# EAGLE design isa_cvx (EAGLE 9.5.2)
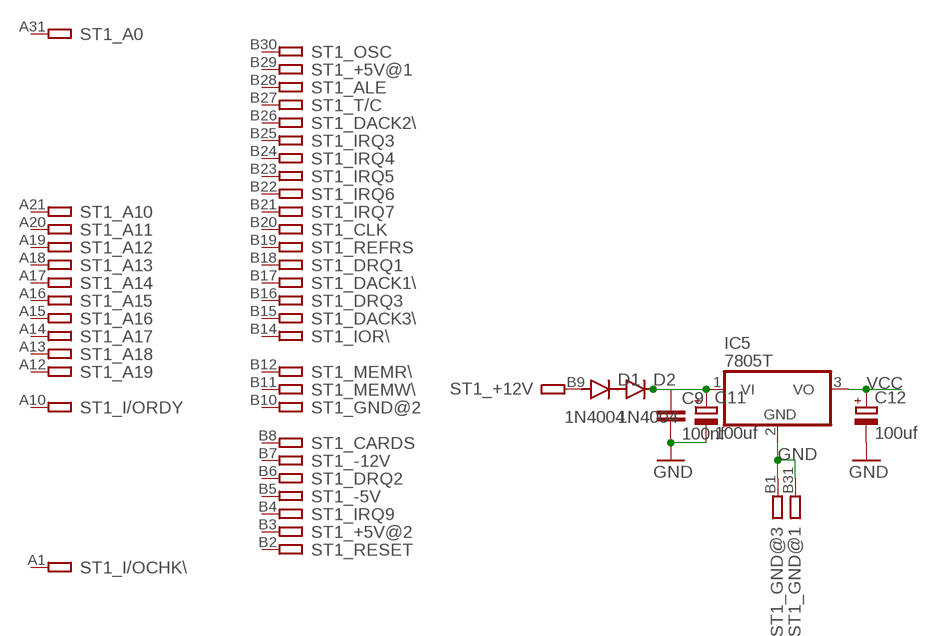
[diagram p0: schematic, sheet 1, part 1 of 2]
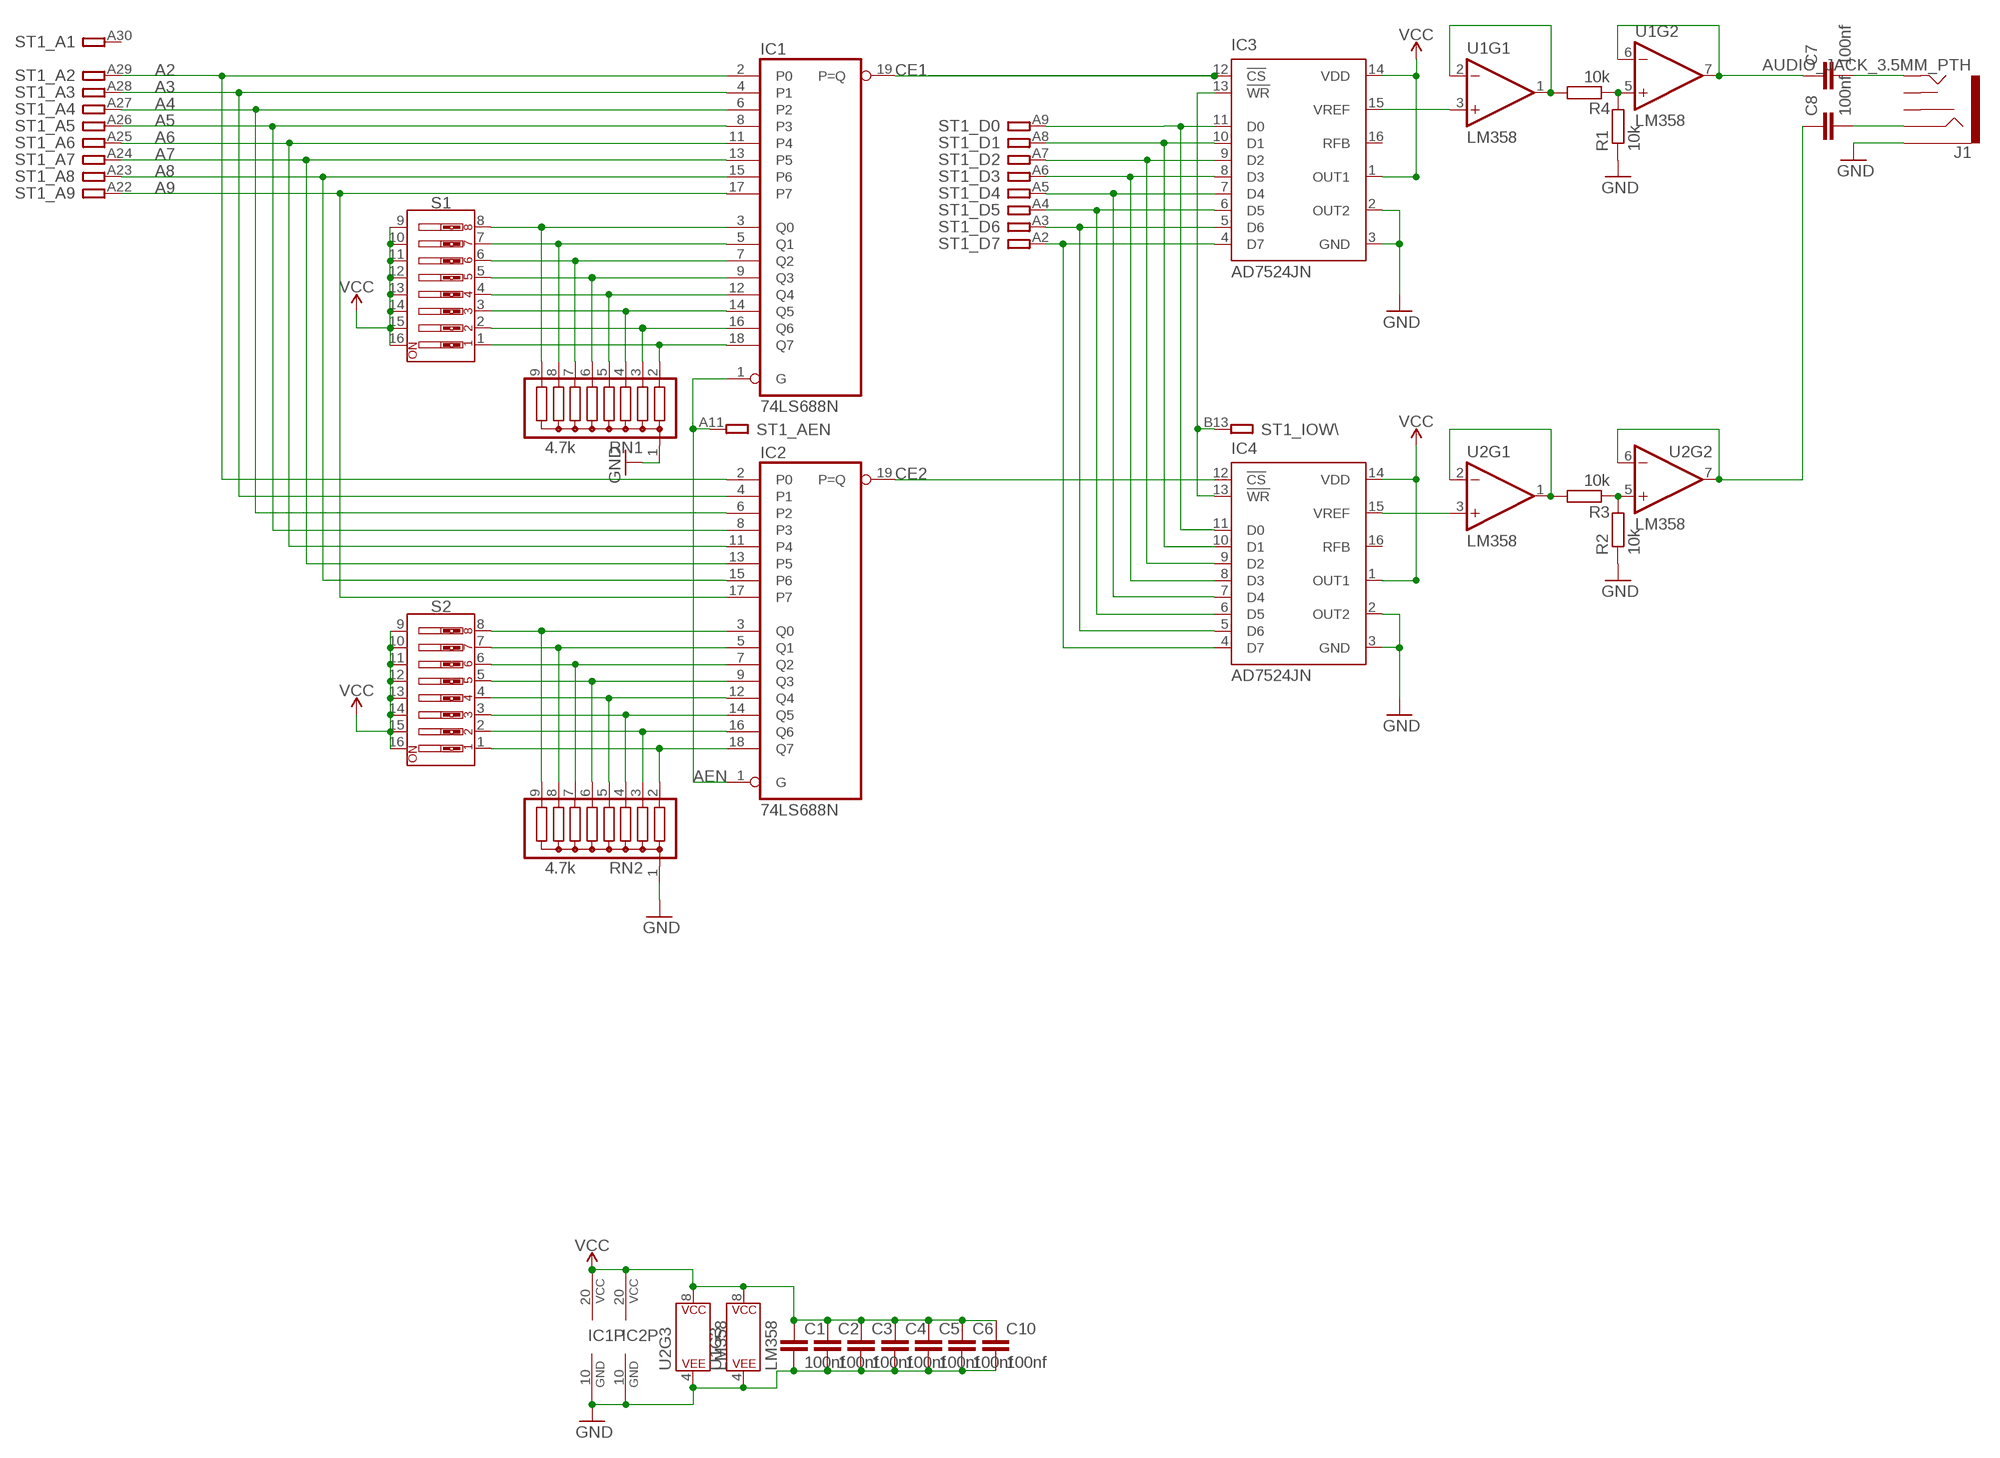
[diagram p1: schematic, sheet 1, part 2 of 2]

## Parts
C1  100nf  C2.5/2  [C2.5-2]
C2  100nf  C2.5/2  [C2.5-2]
C3  100nf  C2.5/2  [C2.5-2]
C4  100nf  C2.5/2  [C2.5-2]
C5  100nf  C2.5/2  [C2.5-2]
C6  100nf  C2.5/2  [C2.5-2]
C7  100nf  C2.5/2  [C2.5-2]
C8  100nf  C2.5/2  [C2.5-2]
C9  100nf  C2.5/2  [C2.5-2]
C10  100nf  C2.5/2  [C2.5-2]
C11  100uf  CPOL-EUE2.5-5  [E2,5-5]
C12  100uf  CPOL-EUE2.5-5  [E2,5-5]
D1  1N4004  [DO41-10]
D2  1N4004  [DO41-10]
IC1  74LS688N  [DIL20]
IC2  74LS688N  [DIL20]
IC3  AD7524JN  [DIL16]
IC4  AD7524JN  [DIL16]
IC5  7805T  [TO220H]
J1  AUDIO_JACK_3.5MM_PTH  [AUDIO-JACK]
R1  10k  R-EU_0207/10  [0207/10]
R2  10k  R-EU_0207/10  [0207/10]
R3  10k  R-EU_0207/10  [0207/10]
R4  10k  R-EU_0207/10  [0207/10]
RN1  4.7k  G08R  [SIL9]
RN2  4.7k  G08R  [SIL9]
S1  DIP-08-PTH  [DIPSWITCH-08]
S2  DIP-08-PTH  [DIPSWITCH-08]
ST1  IBM8BIT  [IBM8BIT]
U1  LM358  [DIP08]
U2  LM358  [DIP08]

## Nets
A2: IC1.2(P0) IC2.2(P0) ST1.A29
A3: IC1.4(P1) IC2.4(P1) ST1.A28
A4: IC1.6(P2) IC2.6(P2) ST1.A27
A5: IC1.8(P3) IC2.8(P3) ST1.A26
A6: IC1.11(P4) IC2.11(P4) ST1.A25
A7: IC1.13(P5) IC2.13(P5) ST1.A24
A8: IC1.15(P6) IC2.15(P6) ST1.A23
A9: IC1.17(P7) IC2.17(P7) ST1.A22
AEN: IC1.1(G) IC2.1(G) ST1.A11
CE1: IC1.19(P=Q) IC3.12(!CS)
CE2: IC2.19(P=Q) IC4.12(!CS)
GND: C1.2 C2.2 C3.2 C4.2 C5.2 C6.2 C9.2 C10.2 C11.- C12.- IC1.10(GND) IC2.10(GND) IC3.2(OUT2) IC3.3(GND) IC4.2(OUT2) IC4.3(GND) IC5.2(GND) J1.SLEEVE R1.1 R2.1 RN1.1 RN2.1 ST1.B1 ST1.B31 U1.4(P$V-) U2.4(P$V-)
N$1: IC3.11(D0) IC4.11(D0) ST1.A9
N$2: IC3.10(D1) IC4.10(D1) ST1.A8
N$3: IC3.9(D2) IC4.9(D2) ST1.A7
N$4: IC3.8(D3) IC4.8(D3) ST1.A6
N$5: IC3.7(D4) IC4.7(D4) ST1.A5
N$6: IC3.6(D5) IC4.6(D5) ST1.A4
N$7: IC3.13(!WR) IC4.13(!WR) ST1.B13
N$8: IC3.4(D7) IC4.4(D7) ST1.A2
N$9: D1.A ST1.B9
N$10: IC1.3(Q0) RN1.9 S1.8
N$11: IC1.5(Q1) RN1.8 S1.7
N$12: IC1.7(Q2) RN1.7 S1.6
N$13: IC1.9(Q3) RN1.6 S1.5
N$14: IC1.12(Q4) RN1.5 S1.4
N$15: IC1.14(Q5) RN1.4 S1.3
N$16: IC1.16(Q6) RN1.3 S1.2
N$17: IC1.18(Q7) RN1.2 S1.1
N$18: IC2.3(Q0) RN2.9 S2.8
N$19: IC2.5(Q1) RN2.8 S2.7
N$20: IC2.7(Q2) RN2.7 S2.6
N$21: IC2.9(Q3) RN2.6 S2.5
N$22: IC2.12(Q4) RN2.5 S2.4
N$23: IC2.14(Q5) RN2.4 S2.3
N$24: IC2.16(Q6) RN2.3 S2.2
N$25: IC2.18(Q7) RN2.2 S2.1
N$26: IC3.5(D6) IC4.5(D6) ST1.A3
N$27: IC3.15(VREF) U1.3(+IN)
N$28: C9.1 C11.+ D2.C IC5.1(VI)
N$29: D1.C D2.A
N$30: R4.2 U1.1(OUT) U1.2(-IN)
N$31: IC4.15(VREF) U2.3(+IN)
N$32: R3.2 U2.1(OUT) U2.2(-IN)
N$33: C8.1 U2.6(-IN) U2.7(OUT)
N$34: C7.1 U1.6(-IN) U1.7(OUT)
N$35: R1.2 R4.1 U1.5(+IN)
N$36: R2.2 R3.1 U2.5(+IN)
N$37: C7.2 J1.TIP
N$38: C8.2 J1.RING
VCC: C1.1 C2.1 C3.1 C4.1 C5.1 C6.1 C10.1 C12.+ IC1.20(VCC) IC2.20(VCC) IC3.1(OUT1) IC3.14(VDD) IC4.1(OUT1) IC4.14(VDD) IC5.3(VO) S1.9 S1.10 S1.11 S1.12 S1.13 S1.14 S1.15 S1.16 S2.9 S2.10 S2.11 S2.12 S2.13 S2.14 S2.15 S2.16 U1.8(P$V+) U2.8(P$V+)
Unconnected: IC3.16(RFB) IC4.16(RFB) J1.RSH J1.TSH ST1.A1 ST1.A10 ST1.A12 ST1.A13 ST1.A14 ST1.A15 ST1.A16 ST1.A17 ST1.A18 ST1.A19 ST1.A20 ST1.A21 ST1.A30 ST1.A31 ST1.B2 ST1.B3 ST1.B4 ST1.B5 ST1.B6 ST1.B7 ST1.B8 ST1.B10 ST1.B11 ST1.B12 ST1.B14 ST1.B15 ST1.B16 ST1.B17 ST1.B18 ST1.B19 ST1.B20 ST1.B21 ST1.B22 ST1.B23 ST1.B24 ST1.B25 ST1.B26 ST1.B27 ST1.B28 ST1.B29 ST1.B30

## Library data of the parts
C1-C10 = capacitor-wima:C: CAPACITOR naming: grid - package width
C11 C12 = rcl:CPOL-EU: POLARIZED CAPACITOR, European symbol; SPICEPREFIX: C
D1 D2 = diode:1N4004: DIODE general purpose rectifier, 1 A
IC1 IC2 = 74xx-us:74*688: 8-bit MAGNITUDE/IDENTITY COMPARATOR, totem pole
IC3 IC4 = analog-devices:AD7524*: 8-Bit Buffered Multiplying DAC Source: http://www.analog.com/UploadedFiles/Data_Sheets/888358036ad7524.pdf; MF: ALTERA CORPORATION; MPN: AD7524JNZ; OC_FARNELL: 9605401; OC_NEWARK: 59K4969
IC5 = linear:78*: Positive VOLTAGE REGULATOR Source: http://cache.national.com/ds/LM/LM78L05.pdf http://www.fairchildsemi.com/ds/LM/LM7805.pdf
J1 = SparkFun-Connectors:AUDIO_JACK_3.5MM: Audio Jack 3.5mm variants of PTH and SMT stereo audio jack with bypass switches. SparkFun Products: SparkFun SparkPunk Sound Kit <[https://www.sparkfun.com/products/11177]> - PTH MP3 Trigger <https://www.sparkfun.com/products/13720> -3.5mm SMD SparkFun PicoBoard <https://www.sparkfun.com/products/11888>- 2.5mm SMD; PROD_ID: CONN-08774; SF_ID: PRT-08032
R1-R4 = rcl:R-EU_: RESISTOR, European symbol; SPICEPREFIX: R
RN1 RN2 = resistor-sil:G08R: SIL RESISTOR; OC_FARNELL: unknown; OC_NEWARK: unknown
S1 S2 = SparkFun-Switches:DIP-08: 8-Position DIP Switch 8-circuit DIP (dual inline package) switch. Commonly used to physcially set a circuit's behavior. SparkFun Products DIP Switch - 8 Position <https://www.sparkfun.com/products/8034> (COM-08034); PROD_ID: SWCH-12197; SF_SKU: COM-08034
ST1 = con-pc:IBM8BIT: 8-bit CARD IBM/PC-AT
U1 U2 = SparkFun-IC-Amplifiers:LM358: LM358 Jellybean op-amp Datasheet <http://www.sparkfun.com/datasheets/Components/General/LM358.pdf> SparkFun Products Op-Amp (Thru-Hole) - LM358 <https://www.sparkfun.com/products/9456> (COM-09456); PROD_ID: IC-09172

## Board
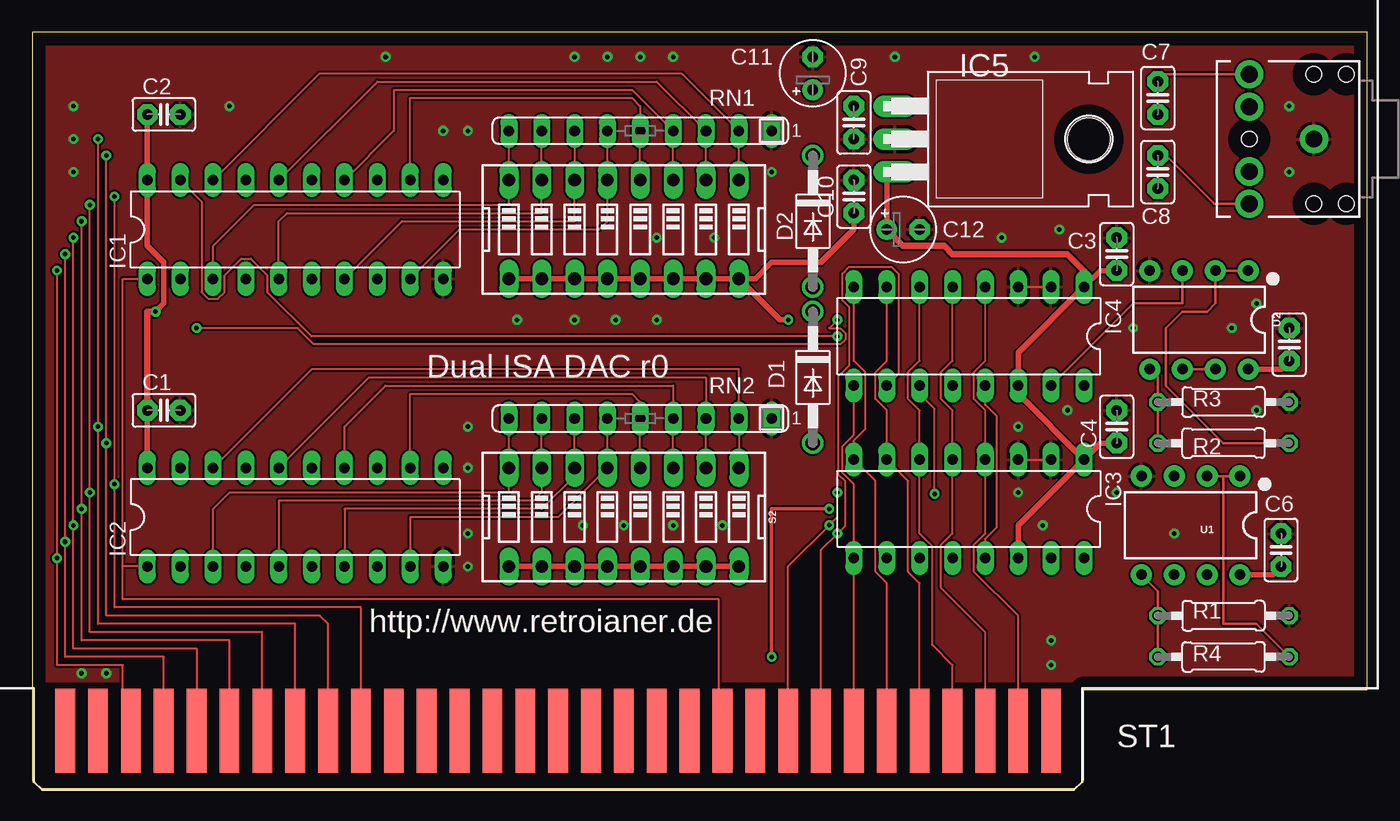
[diagram p2: board, top side]
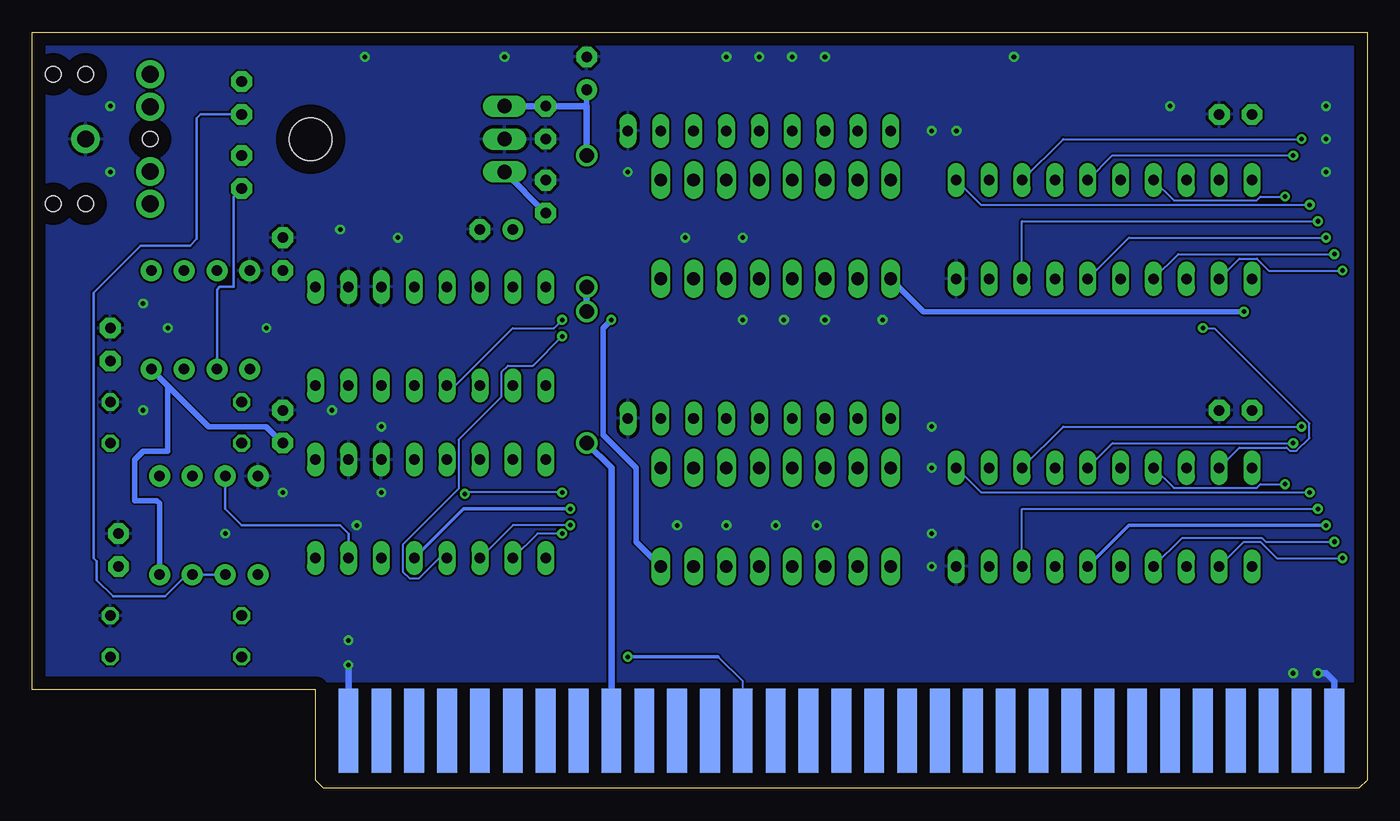
[diagram p3: board, bottom side, seen from below]

Size 103.17 x 58.41 mm. Coordinates in mm from the lower left corner, seen from the top.
Outline: 0,0.64 0.64,0 80.64,0 81.28,0.64 81.28,7.62 103.17,7.62 103.17,58.41 0,58.41 0,0.64
Copper layers (1*16): Top 0.035mm / dielectric 1.5mm / Bottom 0.035mm
Design rules "default": minimum track width 6mil, minimum drill 0.35mm, track to track 6mil, track to pad 6mil, pad to pad 6mil, via to via 6mil, smd to smd 6mil, copper to edge 40mil, drill to drill 6mil, minimum pad ring 10mil, minimum via ring 8mil, stop-mask expansion 4mil, vias tented up to drill 0mil, thermal gap 10mil

### Footprints (pad centres in the part's own frame; a part is rotated, then mirrored left to right if it is on the bottom)
C2.5-2 = drill 0.813 pad 1.6 octagon: 1 -1.27,0; 2 1.27,0
E2,5-5 = drill 0.813 pad 1.6: + -1.27,0 | drill 0.813 pad 1.6 octagon: - 1.27,0
DO41-10 = drill 1.118: A 5.08,0; C -5.08,0
DIL20 = drill 0.813 long: 1 -11.43,-3.81; 2 -8.89,-3.81; 3 -6.35,-3.81; 4 -3.81,-3.81; 5 -1.27,-3.81; 6 1.27,-3.81; 7 3.81,-3.81; 8 6.35,-3.81; 9 8.89,-3.81; 10 11.43,-3.81; 11 11.43,3.81; 12 8.89,3.81; 13 6.35,3.81; 14 3.81,3.81; 15 1.27,3.81; 16 -1.27,3.81; 17 -3.81,3.81; 18 -6.35,3.81; 19 -8.89,3.81; 20 -11.43,3.81
DIL16 = drill 0.813 long: 1 -8.89,-3.81; 2 -6.35,-3.81; 3 -3.81,-3.81; 4 -1.27,-3.81; 5 1.27,-3.81; 6 3.81,-3.81; 7 6.35,-3.81; 8 8.89,-3.81; 9 8.89,3.81; 10 6.35,3.81; 11 3.81,3.81; 12 1.27,3.81; 13 -1.27,3.81; 14 -3.81,3.81; 15 -6.35,3.81; 16 -8.89,3.81
TO220H = drill 1.118 long: 1 -2.54,-10.16; 2 0,-10.16; 3 2.54,-10.16 | hole 3.302: 0,4.826
AUDIO-JACK = drill 1.3 pad 2.184: RING 5,5; RSH 5,2.5; SLEEVE 0,0; TIP 5,-5; TSH 5,-2.5 | hole 1.2: 0,5; -2.5,5; -2.5,-5; 0,-5; 5,0
0207/10 = drill 0.813 octagon: 1 -5.08,0; 2 5.08,0
SIL9 = drill 0.813 long: 1 -10.16,0; 2 -7.62,0; 3 -5.08,0; 4 -2.54,0; 5 0,0; 6 2.54,0; 7 5.08,0; 8 7.62,0; 9 10.16,0
DIPSWITCH-08 = drill 0.97 long: 1 -8.89,-3.81; 2 -6.35,-3.81; 3 -3.81,-3.81; 4 -1.27,-3.81; 5 1.27,-3.81; 6 3.81,-3.81; 7 6.35,-3.81; 8 8.89,-3.81; 9 8.89,3.81; 10 6.35,3.81; 11 3.81,3.81; 12 1.27,3.81; 13 -1.27,3.81; 14 -3.81,3.81; 15 -6.35,3.81; 16 -8.89,3.81
IBM8BIT = smd 1.524 x 6.477: A1 -25.4,5.08; A2 -27.94,5.08; A3 -30.48,5.08; A4 -33.02,5.08; A5 -35.56,5.08; A6 -38.1,5.08; A7 -40.64,5.08; A8 -43.18,5.08; A9 -45.72,5.08; A10 -48.26,5.08; A11 -50.8,5.08; A12 -53.34,5.08; A13 -55.88,5.08; A14 -58.42,5.08; A15 -60.96,5.08; A16 -63.5,5.08; A17 -66.04,5.08; A18 -68.58,5.08; A19 -71.12,5.08; A20 -73.66,5.08; A21 -76.2,5.08; A22 -78.74,5.08; A23 -81.28,5.08; A24 -83.82,5.08; A25 -86.36,5.08; A26 -88.9,5.08; A27 -91.44,5.08; A28 -93.98,5.08; A29 -96.52,5.08; A30 -99.06,5.08; A31 -101.6,5.08 | smd 1.524 x 6.477 bottom: B1 -25.4,5.08; B2 -27.94,5.08; B3 -30.48,5.08; B4 -33.02,5.08; B5 -35.56,5.08; B6 -38.1,5.08; B7 -40.64,5.08; B8 -43.18,5.08; B9 -45.72,5.08; B10 -48.26,5.08; B11 -50.8,5.08; B12 -53.34,5.08; B13 -55.88,5.08; B14 -58.42,5.08; B15 -60.96,5.08; B16 -63.5,5.08; B17 -66.04,5.08; B18 -68.58,5.08; B19 -71.12,5.08; B20 -73.66,5.08; B21 -76.2,5.08; B22 -78.74,5.08; B23 -81.28,5.08; B24 -83.82,5.08; B25 -86.36,5.08; B26 -88.9,5.08; B27 -91.44,5.08; B28 -93.98,5.08; B29 -96.52,5.08; B30 -99.06,5.08; B31 -101.6,5.08
DIP08 = drill 0.813 pad 1.626: 1 -3.81,-3.81; 2 -1.27,-3.81; 3 1.27,-3.81; 4 3.81,-3.81; 5 3.81,3.81; 6 1.27,3.81; 7 -1.27,3.81; 8 -3.81,3.81

### Placement (x,y rotation side)
C1  10.16,29.21 0 top
C2  10.16,52.07 0 top
C3  83.82,41.27 90 top
C4  83.82,27.94 90 top
C5  97.16,34.29 90 top
C6  96.52,18.41 90 top
C7  87,53.34 90 top
C8  87,47.62 90 top
C9  63.5,51.44 270 top
C10  63.5,45.72 90 top
C11  60.33,55.25 90 top
C12  67.31,43.18 0 top
D1  60.33,31.75 270 top
D2  60.33,43.82 270 top
IC1  20.32,43.18 0 top
IC2  20.32,20.95 0 top
IC3  72.39,21.59 180 top
IC4  72.39,34.93 180 top
IC5  76.83,50.16 270 top
J1  99.06,50.16 180 top
R1  92.08,13.34 180 top
R2  92.08,29.84 180 top
R3  92.08,26.67 0 top
R4  92.08,10.16 0 top
RN1  46.99,50.8 180 top
RN2  46.99,28.57 180 top
S1  45.72,43.18 180 top
S2  45.72,20.95 180 top
ST1  104.14,-0.64 0 top
U1  89.53,20.32 180 top
U2  90.17,36.2 180 top

### Tracks (layer width: path | path; a pad name or v marks a point on that pad's centre or on a via)
A2  (via drill 0.35)
  Top 0.152: ST1.A29 6.99,5.08 6.99,9.53 1.91,9.53 v1.91,17.78 v1.91,40.01
  Bottom 0.152: v1.91,40.01 7.61,40.01 8.52,40.92 9.88,40.92 IC1.2 | IC2.2 9.53,19.05 8.26,19.05 6.99,17.78 v1.91,17.78
A3  (via drill 0.35)
  Top 0.152: ST1.A28 10.16,10.16 2.54,10.16 v2.54,19.05 v2.54,41.27
  Bottom 0.152: v2.54,19.05 7.82,19.05 8.13,19.35 14.3,19.35 IC2.4 | IC1.4 14.61,41.27 v2.54,41.27
A4  (via drill 0.35)
  Top 0.152: ST1.A27 12.7,10.79 3.17,10.79 v3.17,20.32 v3.17,42.55
  Bottom 0.152: IC1.6 18.41,42.55 v3.17,42.55
  Bottom 0.254: IC2.6 18.41,20.32 v3.17,20.32
A5  (via drill 0.35)
  Top 0.152: ST1.A26 15.24,11.43 3.81,11.43 v3.81,21.59 v3.81,43.82
  Bottom 0.152: IC2.8 26.67,21.59 v3.81,21.59 | IC1.8 26.67,43.82 v3.81,43.82
A6  (via drill 0.35)
  Top 0.152: ST1.A25 17.78,12.06 4.45,12.06 v4.45,22.86 v4.45,45.09
  Bottom 0.152: IC1.11 29.84,45.09 15.88,45.09 v4.45,45.09 | IC2.11 29.84,22.86 v4.45,22.86
A7  (via drill 0.35)
  Top 0.152: ST1.A24 20.32,12.7 5.08,12.7 v5.08,27.94 v5.08,50.16
  Bottom 0.152: IC2.13 23.5,27.94 v5.08,27.94 | IC1.13 23.5,50.16 v5.08,50.16
A8  (via drill 0.35)
  Top 0.152: ST1.A23 22.86,12.7 22.23,13.34 5.71,13.34 v5.71,26.67 v5.71,48.9
  Bottom 0.152: IC2.15 19.68,26.67 v5.71,26.67 | IC1.15 19.68,48.9 v5.71,48.9
A9  (via drill 0.35)
  Top 0.152: ST1.A22 25.4,13.97 6.35,13.97 v6.35,23.49 v6.35,45.72
  Bottom 0.152: IC1.17 14.96,45.44 8.52,45.44 8.24,45.72 v6.35,45.72 | IC2.17 14.96,23.22 8.52,23.22 8.24,23.49 v6.35,23.49
AEN
  Top 0.152: ST1.A11 53.06,4.72 53.06,14.61 6.99,14.61 6.99,17.14 | 6.99,17.14 6.99,39.37 IC1.1 | IC2.1 6.99,17.14
CE1  (via drill 0.35)
  Top 0.152: IC1.19 13.08,45.34 13.08,38.34 13.6,37.82 14.34,37.82 14.86,38.34 14.86,39.64 16.14,40.92 16.88,40.92 18.16,39.64 18.16,38.34 21.58,34.93 v62.23,34.93
  Bottom 0.152: IC3.12 71.74,17.78 73.29,16.23 74.03,16.23 74.55,16.75 74.55,18.81 70.23,23.13 70.23,26.92 66.93,30.23 66.93,32.14 66.41,32.66 64.49,32.66 v62.23,34.93
CE2  (via drill 0.35)
  Top 0.152: v62.23,36.2 61.59,35.56 61.62,35.53 62.48,35.53 62.84,35.18 62.84,34.67 62.48,34.32 21.75,34.32 20.51,35.56 v12.7,35.56
  Bottom 0.152: IC4.12 70.5,31.11 66.05,35.56 62.87,35.56 v62.23,36.2 | IC2.19 9.88,26.31 6.22,26.31 5.97,26.06 5.46,26.06 4.47,27.05 4.47,28.19 11.81,35.53 12.67,35.53 v12.7,35.56
GND  (via drill 0.35)
  Top 0.152: IC4.3 IC4.2 | IC3.3 IC3.2
  Bottom 0.508: ST1.B31 2.54,8.26 3.17,8.89 v3.81,8.89 | ST1.B1 v78.74,9.53
  other vias: 33.66,17.14 33.66,19.68 33.66,24.76 33.66,27.94 53.34,20.32 49.53,20.32 45.72,20.32 42.55,20.32 57.15,47.62 52.7,42.55 48.26,42.55 37.47,36.2 41.91,36.2 45.09,36.2 48.26,36.2 3.17,47.62 3.17,50.16 3.17,52.71 15.24,52.71 5.71,8.89 94.61,29.21 88.27,19.68 83.82,22.86 76.2,22.86 78.11,20.32 80.01,29.21 76.2,27.94 92.71,35.56 94.61,37.47 85.09,35.56 97.16,52.71 97.16,47.62 79.38,43.18 74.93,42.55 31.75,50.8 33.66,50.8 49.53,56.52 27.3,56.52 66.67,56.52 77.47,56.52 78.74,11.43 46.99,56.52 44.45,56.52 41.91,56.52
  pour Bottom: 0,8.26 0,58.42 103.5,58.42 103.5,8.26
  pour Top: 0,58.42 0,8.26 103.5,8.26 103.5,58.42
N$1  (via drill 0.35)
  Top 0.152: ST1.A9 58.42,17.14 v61.59,20.32 v61.59,20.33 62.23,20.97 62.23,22.22 v62.23,22.86 | v69.75,22.75 69.75,29.31 68.58,30.48 IC4.11
  Bottom 0.152: v61.59,20.33 66.03,20.33 IC3.11 | v62.23,22.86 69.85,22.86 v69.75,22.75
N$2  (via drill 0.35)
  Top 0.152: ST1.A8 60.96,18.41 v62.23,19.68 62.84,20.29 62.84,23.71 62.31,24.24 62.31,31.84 63.14,32.67 63.14,37.18 62.61,37.71 62.61,39.76 63.13,40.28 66.41,40.28 66.93,39.76 66.93,32 IC4.10
  Bottom 0.152: v62.23,19.68 64.14,19.68 IC3.10
N$3
  Top 0.152: ST1.A7 IC3.9 63.5,23.48 62.61,24.37 62.61,26.43 63.5,27.32 IC4.9
N$4
  Top 0.152: ST1.A6 66.04,15.86 65.15,16.75 65.15,23.75 IC3.8 63.5,26.89 64.39,27.78 64.39,32.14 63.5,33.03 IC4.8
N$5
  Top 0.152: ST1.A5 68.58,15.86 67.69,16.75 67.69,23.75 IC3.7 66.04,29.2 65.15,30.09 65.15,32.14 66.04,33.03 IC4.7
N$6
  Top 0.152: ST1.A4 71.12,9.53 69.57,11.07 69.57,18.71 68.58,19.7 IC3.6 68.58,29.2 67.69,30.09 67.69,32.14 68.58,33.03 IC4.6
N$7  (via drill 0.35)
  Top 0.152: IC3.13 73.66,19.27 74.55,20.16 74.55,28.74 73.66,29.63 IC4.13
  Top 0.254: v57.15,10.16 57.15,21.59 v61.59,21.59
  Bottom 0.152: ST1.B13 48.26,8.26 50.16,10.16
  Bottom 0.254: 50.16,10.16 v57.15,10.16 | v61.59,21.59 69.85,21.59 IC3.13
N$8
  Top 0.152: ST1.A2 76.2,13.32 72.77,16.75 72.77,18.81 73.66,19.7 IC3.4 73.66,29.2 72.77,30.09 72.77,32.14 73.66,33.03 IC4.4
N$9
  Bottom 0.508: D1.A 58.42,24.76 ST1.B9
N$10
  Top 0.152: IC1.3 13.97,41.91 17.14,45.09 36.83,45.09 S1.8 RN1.9
N$11
  Top 0.152: IC1.5 19.05,43.82 19.68,44.45 39.37,44.45 S1.7 RN1.8
N$12
  Top 0.152: IC1.7 28.57,43.82 41.91,43.82 S1.6 RN1.7
N$13
  Top 0.152: IC1.9 33.02,43.18 43.81,43.18 44.45,43.82 S1.5 RN1.6
N$14
  Top 0.152: S1.4 RN1.5 46.99,52.71 46.35,53.34 29.21,53.34 IC1.12
N$15
  Top 0.152: S1.3 RN1.4 46.35,53.98 27.94,53.98 27.94,50.8 IC1.14
N$16
  Top 0.152: S1.2 RN1.3 48.26,54.61 26.67,54.61 IC1.16
N$17
  Top 0.152: S1.1 RN1.2 50.16,55.25 22.23,55.25 IC1.18
N$18
  Top 0.152: RN2.9 S2.8 36.83,22.86 15.24,22.86 13.97,21.59 IC2.3
N$19
  Top 0.152: RN2.8 S2.7 39.37,22.86 38.73,22.22 19.05,22.22 IC2.5
N$20
  Top 0.152: RN2.7 S2.6 41.91,24.13 39.37,21.59 24.13,21.59 IC2.7
N$21
  Top 0.152: RN2.6 S2.5 40.64,20.95 29.21,20.95 IC2.9
N$22
  Top 0.152: S2.4 RN2.5 46.99,29.84 46.35,30.48 29.21,30.48 IC2.12
N$23
  Top 0.152: S2.3 RN2.4 49.53,31.11 27.3,31.11 24.13,27.94 IC2.14
N$24
  Top 0.152: S2.2 RN2.3 52.07,31.75 26.04,31.75 IC2.16
N$25
  Top 0.152: S2.1 RN2.2 54.61,32.39 21.59,32.39 IC2.18
N$26
  Top 0.152: ST1.A3 73.66,12.05 70.23,15.48 70.23,18.81 71.12,19.7 IC3.5 71.12,29.2 70.23,30.09 70.23,32.14 71.12,33.03 IC4.5
N$27
  Bottom 0.203: IC3.15 78.74,19.68 79.38,20.32 87,20.32 88.27,21.59 U1.3
N$28
  Bottom 0.406: C11.+ 60.33,52.71
  Bottom 0.508: IC5.1 C9.1 60.33,52.71 D2.C
N$29
  Bottom 0.508: D1.C D2.A
N$30
  Top 0.203: U1.2 92.08,24.13 | 92.08,24.13 U1.1 | R4.2 94.61,12.7 92.08,12.7 92.08,24.13
N$31
  Top 0.203: IC4.15 85.09,37.47 88.9,37.47 U2.3
N$32
  Top 0.203: R3.2 92.08,26.67 87.63,31.11 87.63,35.56 88.9,36.83 90.81,36.83 91.44,37.47 U2.2 U2.1
N$33
  Top 0.203: U2.6 U2.7
  Bottom 0.203: U2.6 88.9,38.53 88.7,38.73 87.63,38.73 87.63,45.72 C8.1
N$34
  Bottom 0.152: U1.7 U1.6
  Bottom 0.203: U1.6 91.24,16.51 92.91,14.83 96.93,14.83 98.18,16.08 98.18,17.54 98.42,17.78 98.42,38.3 94.79,41.94 90.97,41.94 90.46,42.45 90.46,51.78 90.17,52.07 C7.1
N$35
  Top 0.203: U1.5 87,15.24 R1.2 R4.1
N$36
  Top 0.203: U2.5 87,31.75 R2.2 R3.1
N$37
  Top 0.203: J1.TIP 87.55,55.16 C7.2
N$38
  Top 0.203: C8.2 87.63,48.9 91.36,45.16 J1.RING
VCC  (via drill 0.35)
  Top 0.406: S1.9 S1.10 S1.11 S1.12 S1.13 S1.14 S1.15 S1.16 | S2.9 S2.10 S2.11 S2.12 S2.13 S2.14 S2.15 S2.16 | U2.8 96.52,32.39 C5.1 | U1.8 95.89,16.51 C6.1 | IC3.1 82.55,26.67 C4.1 | C3.1 82.55,40.01 IC4.1 76.2,33.66 IC4.14 76.2,30.48 IC3.1 | C2.1 IC1.20 8.89,41.91 10.16,40.64 10.16,37.47 v9.53,36.83 | IC2.20 C1.1 | IC3.14 76.2,20.32 IC3.1 | C10.1 63.5,43.18 60.96,40.64 57.15,40.64 55.88,39.37 S1.16 | S1.16 57.78,36.2 v58.42,36.2 | C12.+ 66.04,46.99 IC5.3
  Top 0.508: C1.1 8.89,36.83 v9.53,36.83 | C12.+ 67.31,41.91 70.48,41.91 71.12,41.27 80.01,41.27 81.28,40.01 IC4.1
  Bottom 0.406: S1.9 34.29,36.83 v9.53,36.83 | U2.8 92.71,31.11 | 92.71,31.11 89.53,27.94 85.09,27.94 C4.1 | U1.8 93.34,22.02 93.55,22.22 95.25,22.22 95.25,25.4 94.61,26.04 92.71,26.04 92.71,31.11 | v58.42,36.2 59.05,35.56 59.05,27.3 56.52,24.76 56.52,19.05 S2.16 | C10.1 IC5.3

### Text on the board
tNames: Dual ISA DAC r0 | http://www.retroianer.de
tStop: v0.9